# Altium schematic sheet MOTOR DRIVER.SchDoc: MOTOR DRIVE 1
size A4; Date: *******; ApprovedBy: *******; CheckedBy: None; Author: *******; CompanyName: *******; DrawnBy: Name; Engineer: *******; Organization: *******; Address1: *******; Address2: *******; Address3: *******; Address4: *******; DocumentNumber: 7; Revision: *******; SheetNumber: 7; SheetTotal: 11; CurrentTime: *******; CurrentDate: *******; Time: *******; DocumentFullPathAndName: *******; DocumentName: *******; ModifiedDate: *******; ImagePath: *******; ProjectName: *******; Application_BuildNumber: *******
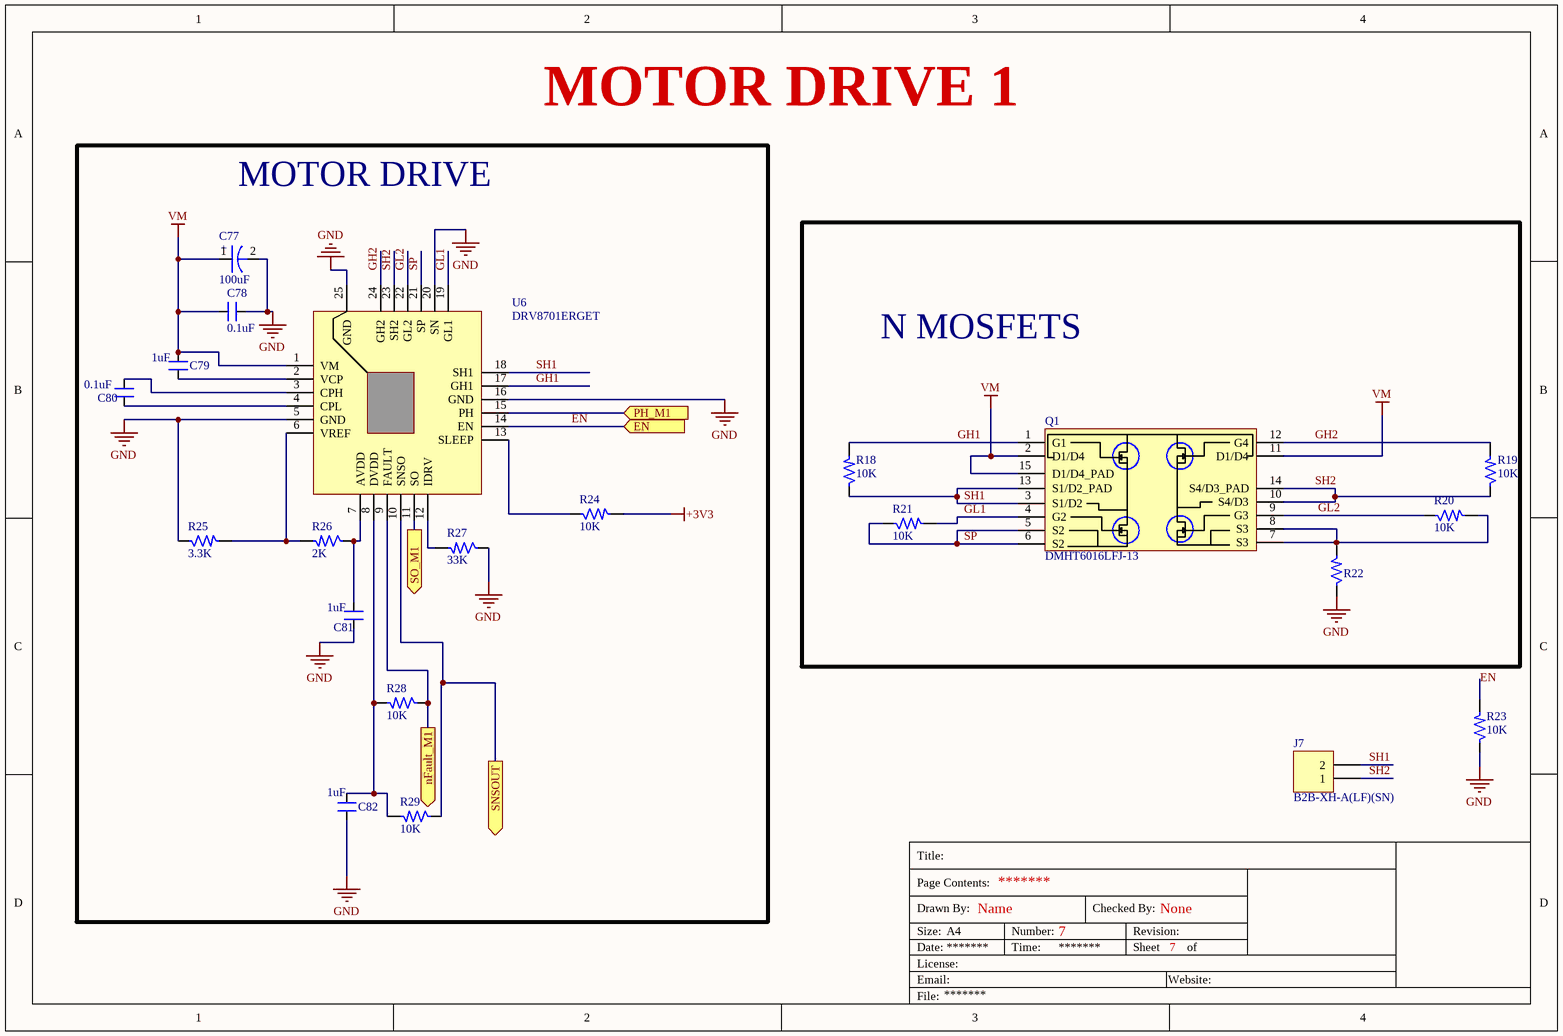
[diagram p0: MOTOR DRIVER.SchDoc]

## Parts
C77  100uF  [ACAP_P236_D305_H303_RAD]
C78  0.1uF  [CAP_0805]
C79  1uF  [CAP_0805]
C80  0.1uF  [CAP_0805]
C81  1uF  [CAP_0805]
C82  1uF  [CAP_0805]
J7  B2B-XH-A(LF)(SN)  [CON2_100_B2B-XH-A_TH_ST]
Q1  DMHT6016LFJ-13  [DFN5045-12_33_212_27X15_SMD_1]
R18  10K  [RES_0805]
R19  10K  [RES_0805]
R20  10K  [RES_0805]
R21  10K  [RES_0805]
R22  RES_50mOHM-2W-2512 Current sense  [RESC6331X80N]  (value not drawn)
R23  10K  [RES_0805]
R24  10K  [RES_0805]
R25  3.3K  [RES_0805]
R26  2K  [RES_0805]
R27  33K  [RES_0805]
R28  10K  [RES_0805]
R29  10K  [RES_0805]
U6  DRV8701ERGET  [VFQFN24_19.6_196_12X32_SMD_1]

## Blocks framed on the sheet
MOTOR DRIVE: C77-C82 R24-R29 U6
N MOSFETS: Q1 R18-R22

## Ports
EN (in), nFault_M1 (out), PH_M1 (in), SNSOUT (out), SO_M1 (out)

## Nets
+3V3: R24.2
GND: C77.2 C78.2 C81.1 C82.1 R22.1 R23.1 R25.1 R27.1 U6.5(GND) U6.16(GND) U6.20(SN) U6.25(GND)
VM: C77.1 C78.1 C79.2 Q1.2(D1/D4) Q1.11(D1/D4) Q1.15(D1/D4_PAD) U6.1(VM)
EN: R23.2 U6.14(EN) ; port EN
GH1: Q1.1(G1) R18.2 U6.17(GH1)
GH2: Q1.12(G4) R19.2 U6.24(GH2)
GL1: Q1.4(G2) R21.2 U6.19(GL1)
GL2: Q1.9(G3) R20.1 U6.22(GL2)
nFault_M1: R28.1 U6.9(FAULT) ; port nFault_M1
PH_M1: U6.15(PH) ; port PH_M1
SH1: J7.2 Q1.3(S1/D2) Q1.13(S1/D2_PAD) R18.1 U6.18(SH1)
SH2: J7.1 Q1.10(S4/D3) Q1.14(S4/D3_PAD) R19.1 U6.23(SH2)
SNSOUT: R29.1 U6.10(SNSO) ; port SNSOUT
SO_M1: U6.11(SO) ; port SO_M1
SP: Q1.5(S2) Q1.6(S2) R21.1 U6.21(SP)
NetC79_1: C79.1 U6.2(VCP)
NetC80_1: C80.1 U6.4(CPL)
NetC80_2: C80.2 U6.3(CPH)
NetC81_2: C81.2 R26.1 U6.7(AVDD)
NetC82_2: C82.2 R28.2 R29.2 U6.8(DVDD)
NetQ1_7: Q1.7(S3) Q1.8(S3) R20.2 R22.2
NetR24_1: R24.1 U6.13(SLEEP)
NetR25_2: R25.2 R26.2 U6.6(VREF)
NetR27_2: R27.2 U6.12(IDRV)

## Notes on the sheet
- Title:
- Drawn By:
- Page Contents:
- Checked By:
- Size:
- Date:
- File:
- License:
- Email:
- A4
- Number:
- Time:
- Revision:
- Sheet
- Website:
- of
- (in symbol CAP-P_100uF-25V-20%-RAD) +

## Library data of the parts
C77 = CAP-P_100uF-25V-20%-RAD: 100µF 25V Aluminum Electrolytic Capacitors Radial, Can - SMD 1000 Hrs @ 105°C; Manufacturer: Nichicon; Manufacturer Part Number: UWT1E101MCL1GS; Alternate Part Number-1: NA; Case/Package: Radial-SMD; Supplier-1: SP ROAD; Supplier Part Number-1: UWT1E101MCL1GS
C78 C80 = CAP_0.1uF-50V-5%-0805: 0.1µF ±5% 50V Ceramic Capacitor X7R 0805 (2012 Metric); Manufacturer: AVX Corporation; Manufacturer Part Number: 08055C104JAT4A; Alternate Part Number-1: 0805B104M500; Case/Package: 0805; Supplier-1: SIRICOM; Supplier Part Number-1: 0805B104J500CT
C79 C81 C82 = CAP_1uF-50V-5%-0805: 1µF ±5% 50V Ceramic Capacitor X7R 0805 (2012 Metric); Manufacturer: Samsung; Manufacturer Part Number: CC0805JKX7R9BB105; Alternate Part Number-1: 0805F105M500NT; Case/Package: 0805; Supplier-1: SIRICOM; Supplier Part Number-1: CL21B105KBFNNNE
J7 = CON-PLG_2X1-100-ST-TH: 2 Pins, 1 Row 2.54mm Pitch, Straight Connector, male; Manufacturer: JST; Mating Part Number: XHP-2; Crimp Part Number: ASXHSXH22K51; Alternate Part Number-1: NA; Manufacturer Part Number: B2B-XH-A(LF)(SN); Case/Package: TH-CON; Supplier-1: SP ROAD; Supplier Part Number-1: B2B-XH-A(LF)(SN)
Q1 = MOSFET-N_60V-14.8A-V-DFN5045-12: Mosfet Array 4 N-Channel 14.8A (Ta) Surface Mount V-DFN5045-12; Manufacturer: ON Semiconductor; Alternate Part Number-1: DMHT3006LFJ-13; Manufacturer Part Number: DMHT6016LFJ-13; Case/Package: DFN5045-12; Supplier-1: LCSC; Supplier Part Number-1: C460986
R18-R21 R23 R24 R28 R29 = RES_10K-0.125W-1%-0805: 10 kOhms ±1% 0.125W, 1/8W Chip Resistor 0805 (2012 Metric) Automotive AEC-Q200 Thick Film; Manufacturer: CTS; Manufacturer Part Number: WR08X1002FTL; Case/Package: 0805; Supplier-1: SIRICOM; Supplier Part Number-1: WR08X1002FTL; Alternate Part Number-1: WR08X1002FTL
R22 = RES_50mOHM-2W-2512 Current sense: 50 mOhms ±1% 2W Chip Resistor 2512 (6432 Metric) Current Sense Thick Film
R25 = RES_3.3K-0.125W-1%-0805: 3.3 kOhms ±1% 0.125W, 1/8W Chip Resistor 0805 (2012 Metric) Thick Film; Manufacturer: Panasonic; Manufacturer Part Number: 1623214-1; Alternate Part Number-1: 0805W8F3301T5E; Case/Package: 0805; Supplier-1: SIRICOM; Supplier Part Number-1: WR08X3301FTL
R26 = RES_2K-0.125W-1%-0805: 2 kOhms ±1% 0.125W, 1/8W Chip Resistor 0805 (2012 Metric) Moisture Resistant Thick Film; Manufacturer: TE Connectivity; Manufacturer Part Number: RC0805FR-072KL; Alternate Part Number-1: NA; Case/Package: 0805; Supplier-1: SIRICOM; Supplier Part Number-1: WR08X2001FTL
R27 = RES_33K-0.125W-1%-0805: Thick Film Resistors - SMD 33KOhms 1/8W 150V33 kOhms ±1% 0.125W, 1/8W Chip Resistor 0805 (2012 Metric) Thick Film; Manufacturer: Vishay BCcomponents; Manufacturer Part Number: CRG0805F33K; Alternate Part Number-1: NA; Case/Package: 0805; Supplier-1: SIRICOM; Supplier Part Number-1: WR08X3302FTL
U6 = IC_DRV8701ERGET: Motor Driver Power MOSFET Parallel 24-VQFN (4x4); Manufacturer: Texas Instruments; Alternate Part Number-1: NA; Manufacturer Part Number: DRV8701ERGET; Case/Package: VFQFN24; Supplier-1: ARROW; Supplier Part Number-1: DRV8701ERGET